# EAGLE design PCB Control (EAGLE 7.1.0)
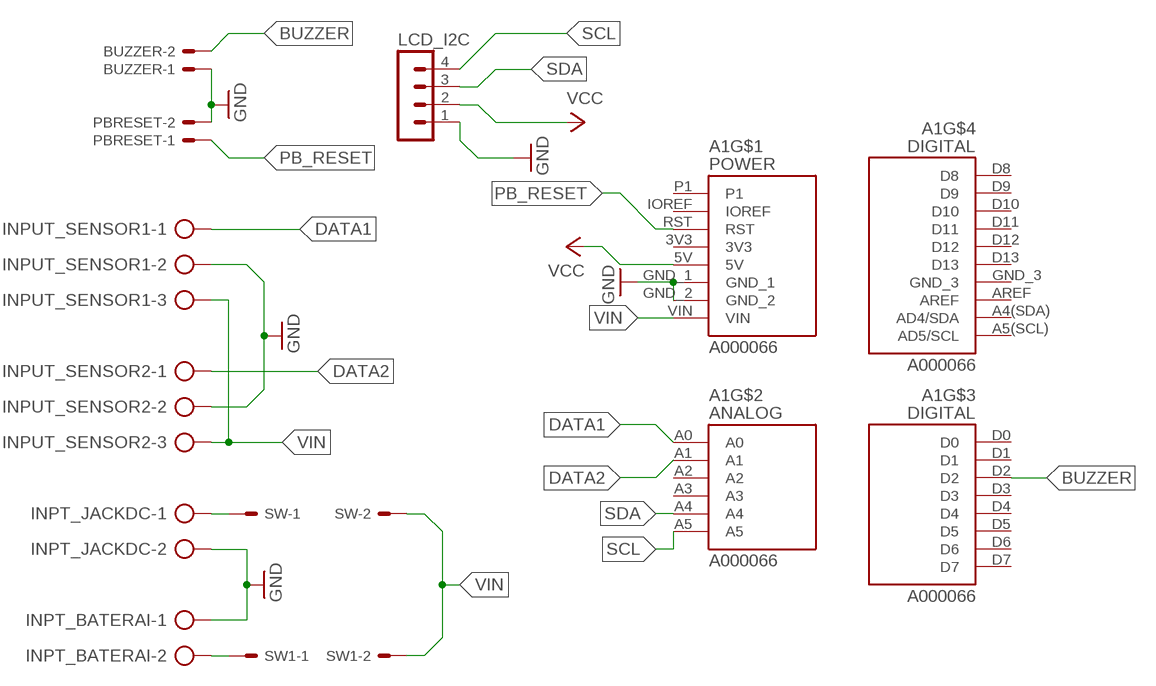
[diagram p0: schematic, sheet 1]

## Parts
A1  A000066  [ARDUINO_A000066]
BUZZER  22-23-2021  [22-23-2021]
INPT_BATERAI  AK500/2  [AK500/2]
INPT_JACKDC  AK500/2  [AK500/2]
INPUT_SENSOR1  AK500/3  [AK500/3]
INPUT_SENSOR2  AK500/3  [AK500/3]
LCD_I2C  MA04-1  [MA04-1]
PBRESET  22-23-2021  [22-23-2021]
SW  22-23-2021  [22-23-2021]
SW1  22-23-2021  [22-23-2021]

## Nets
BUZZER: A1.D2 BUZZER.2
DATA1: A1.A0 INPUT_SENSOR1.1
DATA2: A1.A1 INPUT_SENSOR2.1
GND: A1.GND_1 A1.GND_2 BUZZER.1 INPT_BATERAI.1 INPT_JACKDC.2 INPUT_SENSOR1.2 INPUT_SENSOR2.2 LCD_I2C.1 PBRESET.2
N$1: INPT_JACKDC.1 SW.1
N$2: INPT_BATERAI.2 SW1.1
PB_RESET: A1.RST PBRESET.1
SCL: A1.A5 LCD_I2C.4
SDA: A1.A4 LCD_I2C.3
VCC: A1.5V LCD_I2C.2
VIN: A1.VIN INPUT_SENSOR1.3 INPUT_SENSOR2.3 SW1.2 SW.2
Unconnected: A1.A2 A1.A3 A1.A4(SDA)(AD4/SDA) A1.A5(SCL)(AD5/SCL) A1.AREF A1.D0 A1.D1 A1.D3 A1.D4 A1.D5 A1.D6 A1.D7 A1.D8 A1.D9 A1.D10 A1.D11 A1.D12 A1.D13 A1.IOREF A1.P1

## Power pins joined to a net without a drawn wire
3V3: A1.3V3
GND_3: A1.GND_3

## Library data of the parts
A1 = A000066:A000066: Check availability <https://pricing.snapeda.com/parts/ARDUINO%20UNO%20REV3%20DEVELOPMENT%20BOARD/Arduino/view-part?ref=eda>; AVAILABILITY: Not in stock; CHECK_PRICES: https://www.snapeda.com/parts/ARDUINO%20UNO%20REV3%20DEVELOPMENT%20BOARD/Arduino/view-part/?ref=eda; DESCRIPTION: Microcontroller board based on the ATmega328P; MF: Arduino; MP: ARDUINO UNO REV3 DEVELOPMENT BOARD; PACKAGE: None; PRICE: None; SNAPEDA_LINK: https://www.snapeda.com/parts/ARDUINO%20UNO%20REV3%20DEVELOPMENT%20BOARD/Arduino/view-part/?ref=snap
BUZZER PBRESET SW SW1 = con-molex:22-23-2021: .100" (2.54mm) Center Header - 2 Pin; MF: MOLEX; MPN: 22-23-2021; OC_FARNELL: 1462926; OC_NEWARK: 25C3832
INPT_BATERAI INPT_JACKDC = con-ptr500:AK500/2: CONNECTOR; OC_FARNELL: unknown; OC_NEWARK: unknown
INPUT_SENSOR1 INPUT_SENSOR2 = con-ptr500:AK500/3: CONNECTOR; OC_FARNELL: unknown; OC_NEWARK: unknown
LCD_I2C = con-lstb:MA04-1: PIN HEADER; OC_FARNELL: unknown; OC_NEWARK: unknown

## Board
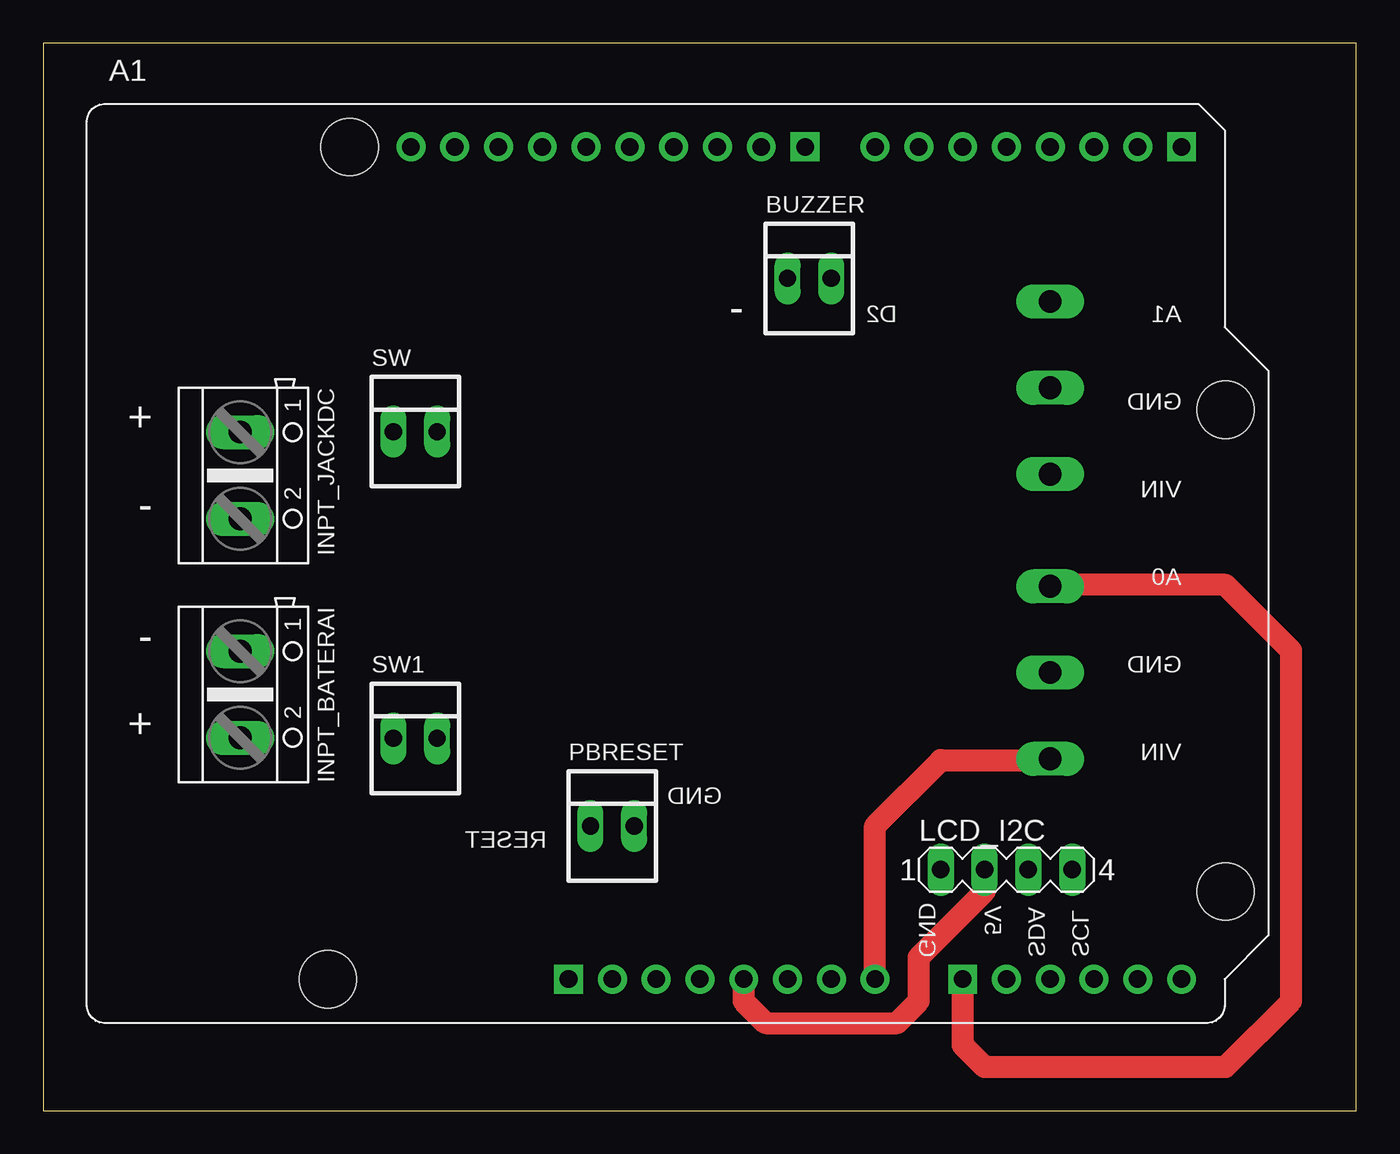
[diagram p1: board, top side]
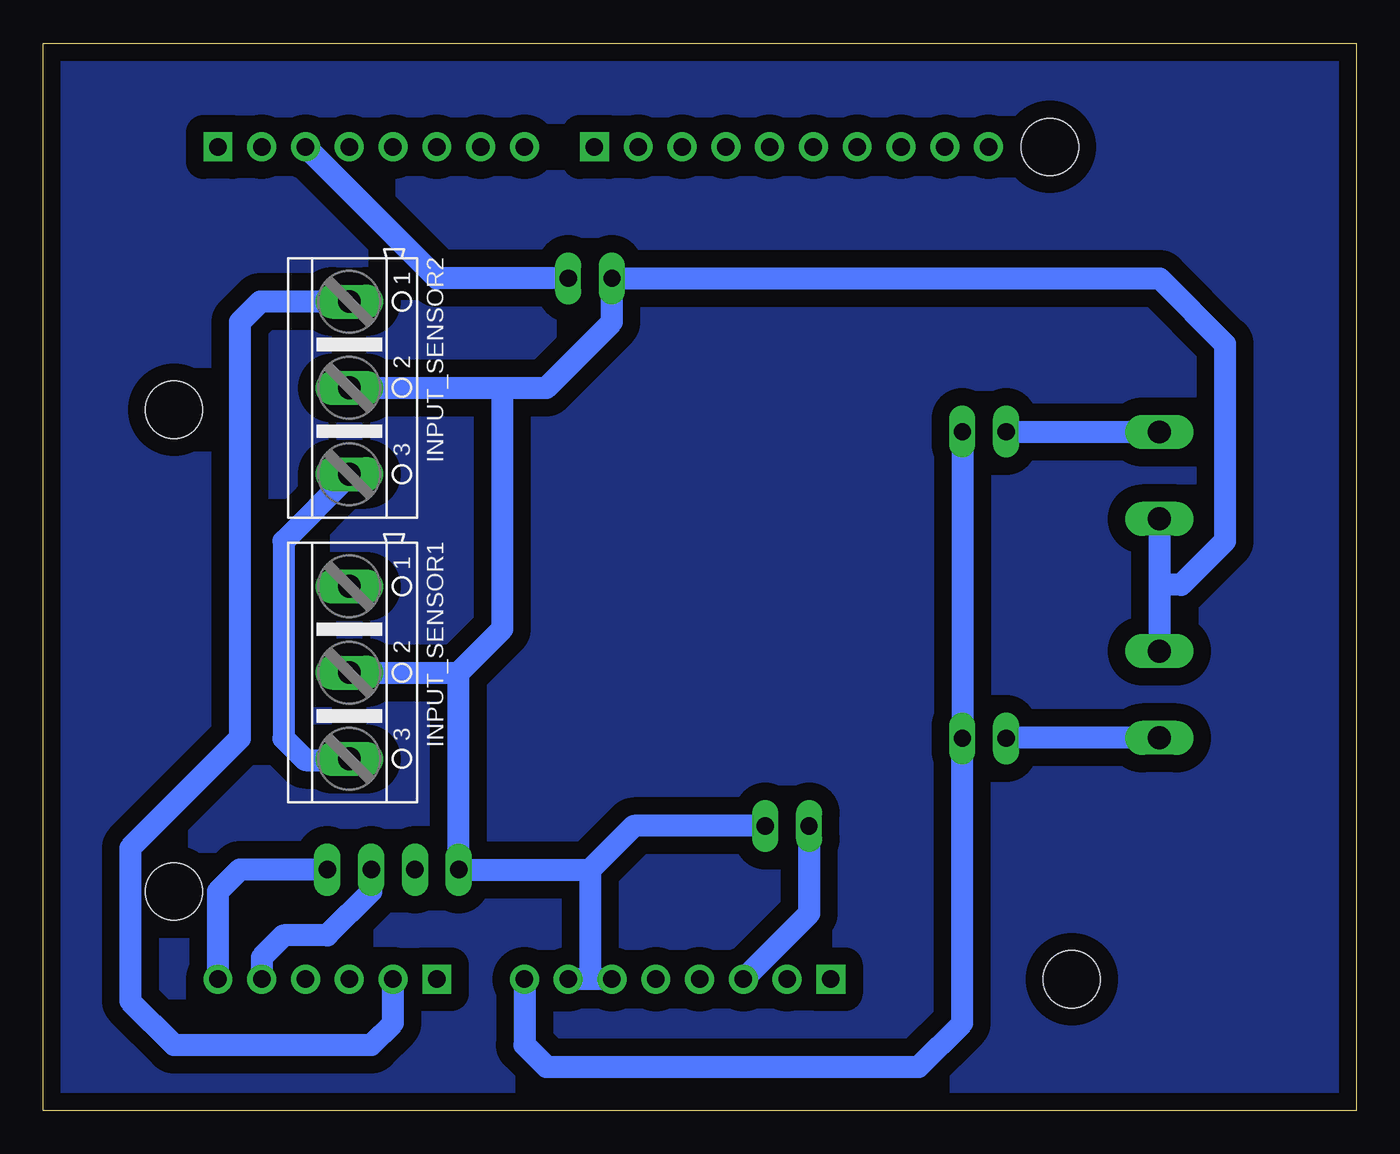
[diagram p2: board, bottom side, seen from below]

Size 76.18 x 61.9 mm. Coordinates in mm from the lower left corner, seen from the top.
Outline: 0,0 76.18,0 76.18,61.9 0,61.9 0,0
Copper layers (1*16): Top 0.035mm / dielectric 1.5mm / Bottom 0.035mm
Design rules "default *": minimum track width 10mil, minimum drill 24mil, track to track 40mil, track to pad 40mil, pad to pad 8mil, via to via 8mil, smd to smd 8mil, copper to edge 40mil, drill to drill 8mil, minimum pad ring 10mil, minimum via ring 8mil, stop-mask expansion 4mil, vias tented up to drill 0mil, thermal gap 10mil

### Footprints (pad centres in the part's own frame; a part is rotated, then mirrored left to right if it is on the bottom)
ARDUINO_A000066 = drill 1.016 pad 1.676: 3V3 35.56,2.54; 5V 38.1,2.54; A1 53.34,2.54; A2 55.88,2.54; A3 58.42,2.54; A4 60.96,2.54; A4(SDA) 21.336,50.8; A5 63.5,2.54; A5(SCL) 18.796,50.8; AREF 23.876,50.8; D1 60.96,50.8; D2 58.42,50.8; D3 55.88,50.8; D4 53.34,50.8; D5 50.8,50.8; D6 48.26,50.8; D7 45.72,50.8; D9 39.116,50.8; D10 36.576,50.8; D11 34.036,50.8; D12 31.496,50.8; D13 28.956,50.8; GND_1 43.18,2.54; GND_2 40.64,2.54; GND_3 26.416,50.8; IOREF 30.48,2.54; RST 33.02,2.54; VIN 45.72,2.54 | drill 1.016 pad 1.676 square: A0 50.8,2.54; D0 63.5,50.8; D8 41.656,50.8; P1 27.94,2.54 | hole 3.3: 66.04,35.56; 66.04,7.62; 15.24,50.8; 13.97,2.54
22-23-2021 = drill 1 long: 1 -1.27,0; 2 1.27,0
AK500/2 = drill 1.321 long: 1 -2.515,0; 2 2.515,0
AK500/3 = drill 1.321 long: 1 -5.004,0; 2 0,0; 3 5.004,0
MA04-1 = drill 1.016 long: 1 -3.81,0; 2 -1.27,0; 3 1.27,0; 4 3.81,0

### Placement (x,y rotation side)
A1  2.54,5.08 0 top
BUZZER  44.45,48.26 0 top
INPT_BATERAI  11.43,24.13 270 top
INPT_JACKDC  11.43,36.83 270 top
INPUT_SENSOR1  58.42,25.4 270 bottom
INPUT_SENSOR2  58.42,41.91 270 bottom
LCD_I2C  55.88,13.97 0 top
PBRESET  33.02,16.51 0 top
SW  21.59,39.37 0 top
SW1  21.59,21.59 0 top

### Tracks (layer width: path | path; a pad name or v marks a point on that pad's centre or on a via)
BUZZER
  Bottom 1.27: BUZZER.2 53.34,48.26 A1.D2
DATA1
  Top 1.27: A1.A0 53.34,3.81 54.61,2.54 68.58,2.54 72.39,6.35 72.39,26.67 68.58,30.48 58.5,30.48 INPUT_SENSOR1.1
DATA2
  Bottom 1.27: INPUT_SENSOR2.1 63.58,46.91 64.77,45.72 64.77,21.59 71.12,15.24 71.12,6.35 68.58,3.81 57.15,3.81 55.88,5.08 A1.A1
GND
  Bottom 1.27: INPT_JACKDC.2 11.43,30.48 | 11.43,30.48 INPT_BATERAI.1 | 11.43,30.48 10.16,30.48 7.62,33.02 7.62,44.45 11.43,48.26 BUZZER.1 43.18,45.72 46.99,41.91 49.53,41.91 | INPUT_SENSOR2.2 49.53,41.91 | INPUT_SENSOR1.2 52.07,25.4 | 52.07,25.4 49.53,27.94 49.53,41.91 | 52.07,25.4 LCD_I2C.1 44.45,13.97 | A1.GND_2 44.45,7.62 | 44.45,7.62 A1.GND_1 | PBRESET.2 41.91,16.51 44.45,13.97 | 44.45,13.97 44.45,7.62
N$1
  Bottom 1.27: INPT_JACKDC.1 20.32,39.34 SW.1
N$2
  Bottom 1.27: INPT_BATERAI.2 20.32,21.61 SW1.1
N$3
  pour Bottom: 0,62.23 76.2,62.23 76.2,0 0,0
PB_RESET
  Bottom 1.27: PBRESET.1 31.75,11.43 A1.RST
SCL
  Bottom 1.27: LCD_I2C.4 64.77,13.97 66.04,12.7 A1.A5
SDA
  Bottom 1.27: LCD_I2C.3 57.15,12.7 59.69,10.16 62.23,10.16 63.5,8.89 A1.A4
VCC
  Top 1.27: A1.5V 40.64,6.35 41.91,5.08 49.53,5.08 50.8,6.35 50.8,8.89 54.61,12.7 LCD_I2C.2
VIN
  Top 1.27: A1.VIN 48.26,16.51 52.07,20.32 58.34,20.32 INPUT_SENSOR1.3
  Bottom 1.27: SW.2 SW1.2 22.86,5.08 25.4,2.54 46.99,2.54 48.26,3.81 A1.VIN | INPUT_SENSOR2.3 58.42,36.83 62.23,33.02 62.23,21.59 60.96,20.32 58.5,20.32 INPUT_SENSOR1.3

### Text on the board
tNames: - | D2 | A1 | GND | + | VIN | - | A0 | - | GND | + | VIN | GND | RESET | 5V | GND | SDA | SCL